# EAGLE schematic newDCDCMirror (EAGLE 9.0.1)
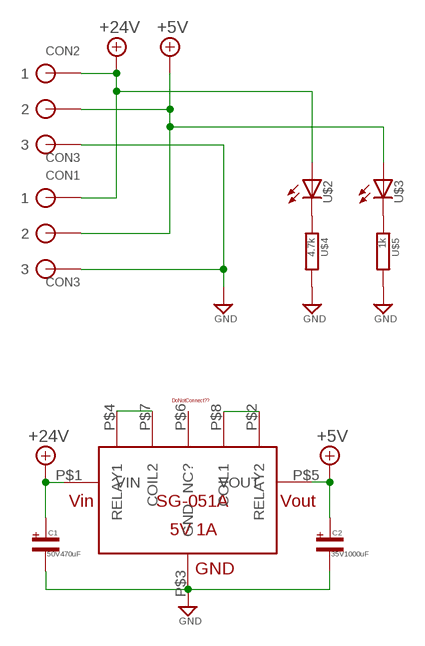
[diagram p0: schematic, sheet 1]

## Parts
C1  50V470uF  コンデンサ(電解)E5-10.5  [D=2,φ=10,5]
C2  35V1000uF  コンデンサ(電解)E5-13  [D=2,φ=13]
CON1  CON3  [CON3]
CON2  CON3  [CON3]
U$1  SG-051A  [SG-051A]
U$2  LED(砲弾型)3  [LED3MM]
U$3  LED(砲弾型)3  [LED3MM]
U$4  4.7k  抵抗0805  [0805]
U$5  1k  抵抗0805  [0805]

## Nets
+5V: C2.+ CON1.P$2 CON2.P$2 U$1.P$5(VOUT) U$3.A
+24V: C1.+ CON1.P$1 CON2.P$1 U$1.P$1(VIN) U$2.A
GND: C1.- C2.- CON1.P$3 CON2.P$3 U$1.P$3(GND) U$4.2 U$5.2
N$4: U$1.P$4(RELAY1) U$1.P$7(COIL2)
N$5: U$1.P$2(RELAY2) U$1.P$8(COIL1)
N$9: U$2.K U$4.1
N$10: U$3.K U$5.1
Unconnected: U$1.P$6(NC?)

## Library data of the parts
C1 C2 = (Foundation)電解コンデンサ:コンデンサ(電解): POLARIZED CAPACITOR, European symbol
CON1 CON2 = (コネクタ)XH:CON3: low insertion CON
U$1 = (DC降圧)SG-051A:SG-051A
U$2 U$3 = (半導体)LED:LED(砲弾型)
U$4 U$5 = (Foundation)表面実装RC:抵抗